# EAGLE design ridicideskaV3 (EAGLE 7.2.0)
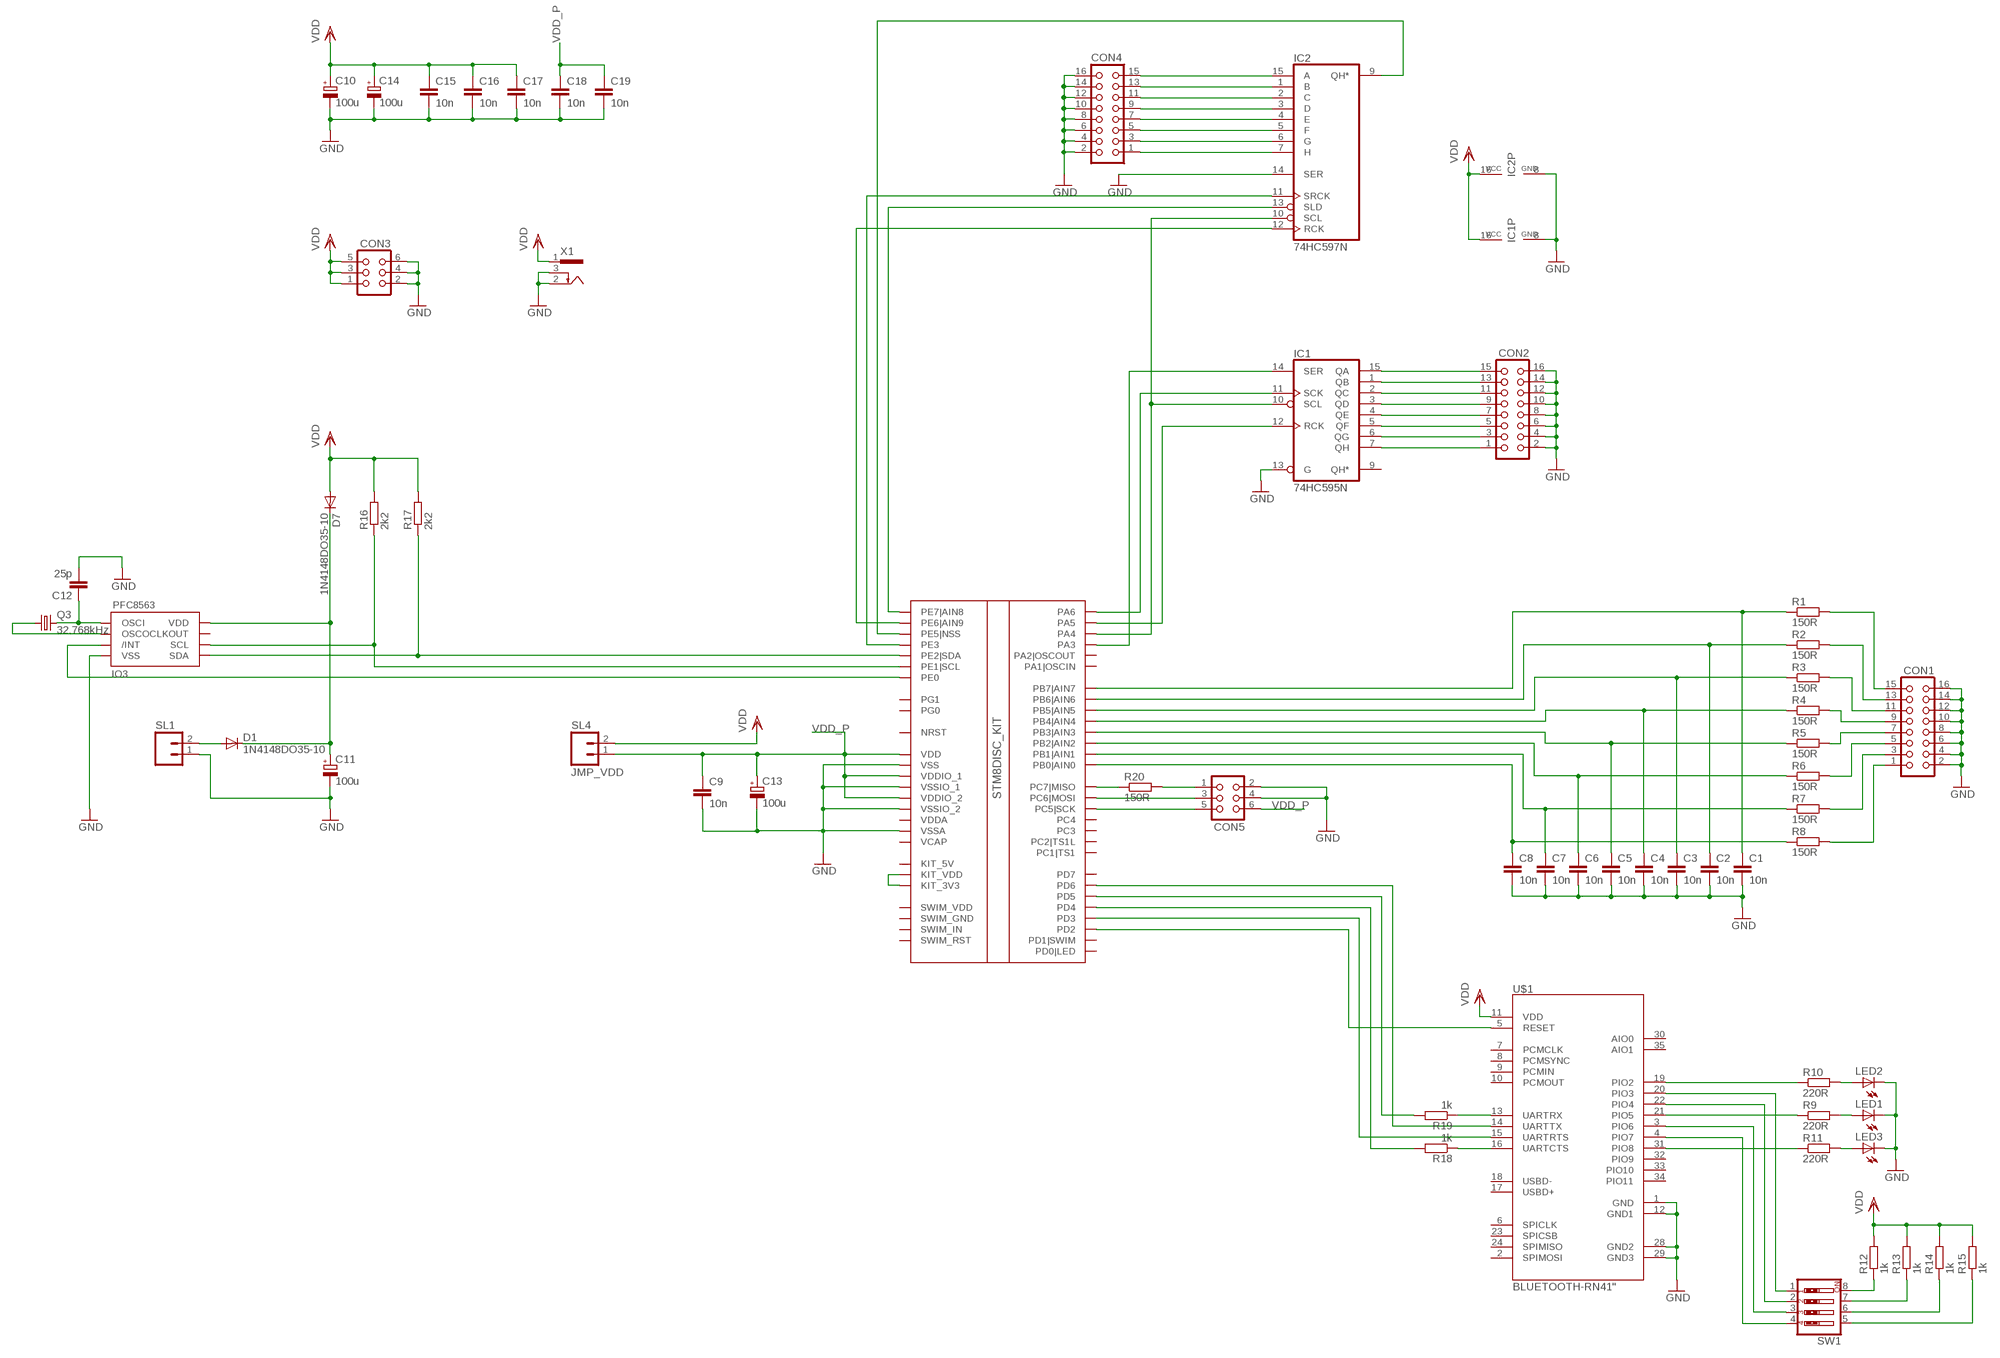
[diagram p0: schematic, sheet 1]

## Parts
C1  10n  C-EUC0805  [C0805]
C2  10n  C-EUC0805  [C0805]
C3  10n  C-EUC0805  [C0805]
C4  10n  C-EUC0805  [C0805]
C5  10n  C-EUC0805  [C0805]
C6  10n  C-EUC0805  [C0805]
C7  10n  C-EUC0805  [C0805]
C8  10n  C-EUC0805  [C0805]
C9  10n  C-EU050-045X075  [C050-045X075]
C10  100u  CPOL-EUE5-10.5  [E5-10,5]
C11  100u  CPOL-EUE5-10.5  [E5-10,5]
C12  25p  C-EUC0603  [C0603]
C13  100u  CPOL-EUE5-10.5  [E5-10,5]
C14  100u  CPOL-EUE5-10.5  [E5-10,5]
C15  10n  C-EU050-045X075  [C050-045X075]
C16  10n  C-EU050-045X075  [C050-045X075]
C17  10n  C-EUC0805  [C0805]
C18  10n  C-EUC0805  [C0805]
C19  10n  C-EUC0805  [C0805]
CON1  CON16  [CON16]
CON2  CON16  [CON16]
CON3  CON06  [CON06]
CON4  CON16  [CON16]
CON5  CON06  [CON06]
D1  1N4148DO35-10  [DO35-10]
D7  1N4148DO35-10  [DO35-10]
IC1  74HC595N  [DIL16]
IC2  74HC597N  [DIL16]
IO1  STM8_KIT  [STM8SDISCOVERY]
IO3  PFC8563  [SO08]
LED1  LED3MM  [LED3MM]
LED2  LED3MM  [LED3MM]
LED3  LED3MM  [LED3MM]
Q3  32.768kHz  CRYSTALTC26V  [TC26V]
R1  150R  R-EU_0207/12  [0207/12]
R2  150R  R-EU_0207/12  [0207/12]
R3  150R  R-EU_0207/12  [0207/12]
R4  150R  R-EU_0207/12  [0207/12]
R5  150R  R-EU_0207/12  [0207/12]
R6  150R  R-EU_0207/12  [0207/12]
R7  150R  R-EU_0207/12  [0207/12]
R8  150R  R-EU_0207/12  [0207/12]
R9  220R  R-EU_0207/12  [0207/12]
R10  220R  R-EU_0207/12  [0207/12]
R11  220R  R-EU_0207/12  [0207/12]
R12  1k  R-EU_0207/12  [0207/12]
R13  1k  R-EU_0207/12  [0207/12]
R14  1k  R-EU_0207/12  [0207/12]
R15  1k  R-EU_0207/12  [0207/12]
R16  2k2  R-EU_0207/12  [0207/12]
R17  2k2  R-EU_0207/12  [0207/12]
R18  1k  R-EU_0207/12  [0207/12]
R19  1k  R-EU_0207/12  [0207/12]
R20  150R  R-EU_R0805  [R0805]
SL1  M02  [02P]
SL4  JMP_VDD  M02  [02P]
SW1  SW_DIP-4  [EDG-04]
U$1  BLUETOOTH-RN41"  [RN41]
X1  733980-62  [733980-62]

## Nets
GND: C1.2 C2.2 C3.2 C4.2 C5.2 C6.2 C7.2 C8.2 C9.2 C10.- C11.- C12.2 C13.- C14.- C15.2 C16.2 C17.2 C18.2 C19.2 CON1.2 CON1.4 CON1.6 CON1.8 CON1.10 CON1.12 CON1.14 CON1.16 CON2.2 CON2.4 CON2.6 CON2.8 CON2.10 CON2.12 CON2.14 CON2.16 CON3.2 CON3.4 CON3.6 CON4.2 CON4.4 CON4.6 CON4.8 CON4.10 CON4.12 CON4.14 CON4.16 CON5.2 CON5.4 IC1.8(GND) IC1.13(G) IC2.8(GND) IC2.14(SER) IO1.VSS IO1.VSSA IO1.VSSIO_1 IO1.VSSIO_2 IO3.4(VSS) LED1.K(C) LED2.K(C) LED3.K(C) SL1.1 U$1.1(GND) U$1.12(GND1) U$1.28(GND2) U$1.29(GND3) X1.2 X1.3
N$1: IC1.14(SER) IO1.PA3
N$2: D1.A SL1.2
N$3: C8.1 IO1.PB0(PB0|AIN0) R8.1
N$4: C7.1 IO1.PB1(PB1|AIN1) R7.1
N$5: C6.1 IO1.PB2(PB2|AIN2) R6.1
N$6: CON1.15 R1.2
N$7: CON1.13 R2.2
N$8: CON1.11 R3.2
N$9: CON1.9 R4.2
N$10: CON1.1 R8.2
N$11: IC1.11(SCK) IO1.PA6
N$12: IC1.10(SCL) IC2.10(SCL) IO1.PA4
N$13: IC1.12(RCK) IO1.PA5
N$14: CON2.15 IC1.15(QA)
N$15: CON2.13 IC1.1(QB)
N$16: CON2.11 IC1.2(QC)
N$17: CON2.9 IC1.3(QD)
N$18: CON2.7 IC1.4(QE)
N$19: CON2.5 IC1.5(QF)
N$20: CON2.3 IC1.6(QG)
N$21: CON2.1 IC1.7(QH)
N$22: IC2.13(SLD) IO1.PE7(PE7|AIN8)
N$23: IO1.PE2(PE2|SDA) IO3.5(SDA) R17.1
N$24: IC2.9(QH*) IO1.PE5(PE5|NSS)
N$25: CON1.3 R7.2
N$26: C5.1 IO1.PB3(PB3|AIN3) R5.1
N$27: C1.1 IO1.PB7(PB7|AIN7) R1.1
N$28: IO1.PE1(PE1|SCL) IO3.6(SCL) R16.1
N$29: C11.+ D1.C D7.C IO3.8(VDD)
N$30: IO1.PE0 IO3.3(/INT)
N$31: CON4.15 IC2.15(A)
N$32: CON4.13 IC2.1(B)
N$33: CON4.11 IC2.2(C)
N$34: CON4.9 IC2.3(D)
N$35: CON4.7 IC2.4(E)
N$36: CON4.5 IC2.5(F)
N$37: CON4.3 IC2.6(G)
N$38: CON4.1 IC2.7(H)
N$39: C12.1 IO3.1(OSCI) Q3.2
N$40: IO3.2(OSCO) Q3.1
N$41: C2.1 IO1.PB6(PB6|AIN6) R2.1
N$42: R19.1 U$1.13(UARTRX)
N$43: C3.1 IO1.PB5(PB5|AIN5) R3.1
N$44: C4.1 IO1.PB4(PB4|AIN4) R4.1
N$45: CON1.5 R6.2
N$46: CON1.7 R5.2
N$47: IO1.PD5 R19.2
N$48: IO1.PD6 U$1.14(UARTTX)
N$49: LED1.A R9.2
N$50: R9.1 U$1.21(PIO5)
N$51: R10.1 U$1.19(PIO2)
N$52: LED2.A R10.2
N$53: SW1.1 U$1.20(PIO3)
N$54: SW1.2 U$1.22(PIO4)
N$55: SW1.3 U$1.3(PIO6)
N$56: SW1.4 U$1.4(PIO7)
N$57: R11.1 U$1.31(PIO8)
N$58: LED3.A R11.2
N$59: R12.1 SW1.8
N$60: R13.1 SW1.7
N$61: R14.1 SW1.6
N$62: R15.1 SW1.5
N$63: IO1.PD4 R18.2
N$64: IO1.PD3 U$1.15(UARTRTS)
N$65: R18.1 U$1.16(UARTCTS)
N$66: IC2.12(RCK) IO1.PE6(PE6|AIN9)
N$67: IC2.11(SRCK) IO1.PE3
N$68: IO1.KIT_3V3 IO1.KIT_VDD
N$69: IO1.PD2 U$1.5(RESET)
N$70: IO1.PC7(PC7|MISO) R20.1
N$71: CON5.1 R20.2
N$72: CON5.3 IO1.PC6(PC6|MOSI)
N$73: CON5.5 IO1.PC5(PC5|SCK)
VDD: C10.+ C14.+ C15.1 C16.1 C17.1 CON3.1 CON3.3 CON3.5 D7.A IC1.16(VCC) IC2.16(VCC) R12.2 R13.2 R14.2 R15.2 R16.2 R17.2 SL4.2 U$1.11(VDD) X1.1
VDD_P: C9.1 C13.+ C18.1 C19.1 CON5.6 IO1.VDD IO1.VDDIO_1 IO1.VDDIO_2 SL4.1
Unconnected: IC1.9(QH*) IO1.KIT_5V IO1.NRST IO1.PA1(PA1|OSCIN) IO1.PA2(PA2|OSCOUT) IO1.PC1(PC1|TS1) IO1.PC2(PC2|TS1L) IO1.PC3 IO1.PC4 IO1.PD0(PD0|LED) IO1.PD1(PD1|SWIM) IO1.PD7 IO1.PG0 IO1.PG1 IO1.SWIM_GND IO1.SWIM_IN IO1.SWIM_RST IO1.SWIM_VDD IO1.VCAP IO1.VDDA IO3.7(CLKOUT) U$1.2(SPIMOSI) U$1.6(SPICLK) U$1.7(PCMCLK) U$1.8(PCMSYNC) U$1.9(PCMIN) U$1.10(PCMOUT) U$1.17(USBD+) U$1.18(USBD-) U$1.23(SPICSB) U$1.24(SPIMISO) U$1.30(AIO0) U$1.32(PIO9) U$1.33(PIO10) U$1.34(PIO11) U$1.35(AIO1)

## Library data of the parts
C1-C9 C12 C15-C19 = rcl:C-EU: CAPACITOR, European symbol
C10 C11 C13 C14 = resistor:CPOL-EU: POLARIZED CAPACITOR, European symbol
CON1 CON2 CON4 = con-harting:CON16: CONNECTOR; OC_FARNELL: unknown; OC_NEWARK: unknown
CON3 CON5 = con-harting:CON06: CONNECTOR; OC_FARNELL: unknown; OC_NEWARK: unknown
D1 D7 = diode:1N4148: DIODE high speed (Philips)
IC1 = 74xx-eu:74*595: 8-bit SHIFT REGISTER, output latch
IC2 = 74xx-eu:74*597: 8-bit SHIFT REGISTER, input latch
IO1 = atypPouzdra:STM8_KIT
IO3 = atypPouzdra:PFC8563
LED1-LED3 = led:LED: LED OSRAM: - CHIPLED LG R971, LG N971, LY N971, LG Q971, LY Q971, LO R971, LY R971 LH N974, LH R974 LS Q976, LO Q976, LY Q976 LO Q996 - Hyper CHIPLED LW Q18S LB Q993, LB Q99A, LB R99A - SideLED LS A670, LO A670, LY A670, LG A670, LP A670 LB A673, LV A673, LT A673, LW A673 LH A674 LY A675 LS A676, LA A676, LO A676, LY A676, LW A676 LS A679, LY A679, LG A679 - Hyper Micro SIDELED® LS Y876, LA Y876, LO Y876, LY Y876 LT Y87S - SmartLED LW L88C, LW L88S LB L89C, LB L89S, LG L890 LS L89K, LO L89K, LY L89K LS L896, LA L896, LO L896, LY L896 - TOPLED LS T670, LO T670, LY T670, LG T670, LP T670 LSG T670, LSP T670, LSY T670, LOP T670, LYG T670 LG T671, LOG T671, LSG T671 LB T673, LV T673, LT T673, LW T673 LH T674 LS T676, LA T676, LO T676, LY T676, LB T676, LH T676, LSB T676, LW T676 LB T67C, LV T67C, LT T67C, LS T67K, LO T67K, LY T67K, LW E67C LS E67B, LA E67B, LO E67B, LY E67B, LB E67C, LV E67C, LT E67C LW T67C LS T679, LY T679, LG T679 LS T770, LO T770, LY T770, LG T770, LP T770 LB T773, LV T773, LT T773, LW T773 LH T774 LS E675, LA E675, LY E675, LS T675 LS T776, LA T776, LO T776, LY T776, LB T776 LHGB T686 LT T68C, LB T68C - Hyper Mini TOPLED® LB M676 - Mini TOPLED Santana® LG M470 LS M47K, LO M47K, LY M47K Source: http://www.osram.convergy.de LUXEON: - LUMILED® LXK2-PW12-R00, LXK2-PW12-S00, LXK2-PW14-U00, LXK2-PW14-V00 LXK2-PM12-R00, LXK2-PM12-S00, LXK2-PM14-U00 LXK2-PE12-Q00, LXK2-PE12-R00, LXK2-PE12-S00, LXK2-PE14-T00, LXK2-PE14-U00 LXK2-PB12-K00, LXK2-PB12-L00, LXK2-PB12-M00, LXK2-PB14-N00, LXK2-PB14-P00, LXK2-PB14-Q00 LXK2-PR12-L00, LXK2-PR12-M00, LXK2-PR14-Q00, LXK2-PR14-R00 LXK2-PD12-Q00, LXK2-PD12-R00, LXK2-PD12-S00 LXK2-PH12-R00, LXK2-PH12-S00 LXK2-PL12-P00, LXK2-PL12-Q00, LXK2-PL12-R00 Source: www.luxeon.com KINGBRIGHT: KA-3528ASYC Source: www.kingbright.com
Q3 = crystal:CRYSTAL: CRYSTAL; OC_FARNELL: unknown; OC_NEWARK: unknown
R1-R20 = rcl:R-EU_: RESISTOR, European symbol
SL1 SL4 = con-amp-quick:M02: AMP QUICK CONNECTOR; OC_FARNELL: unknown; OC_NEWARK: unknown
SW1 = special:SW_DIP-4: DIP SWITCH
U$1 = SparkFun-RF:BLUETOOTH-RN41: Bluetooth SMD module
X1 = con-conrad:73398?: FEMALE PRINT CONNECTOR Niedervolt-Steckverbinder Distributor Conrad

## Board
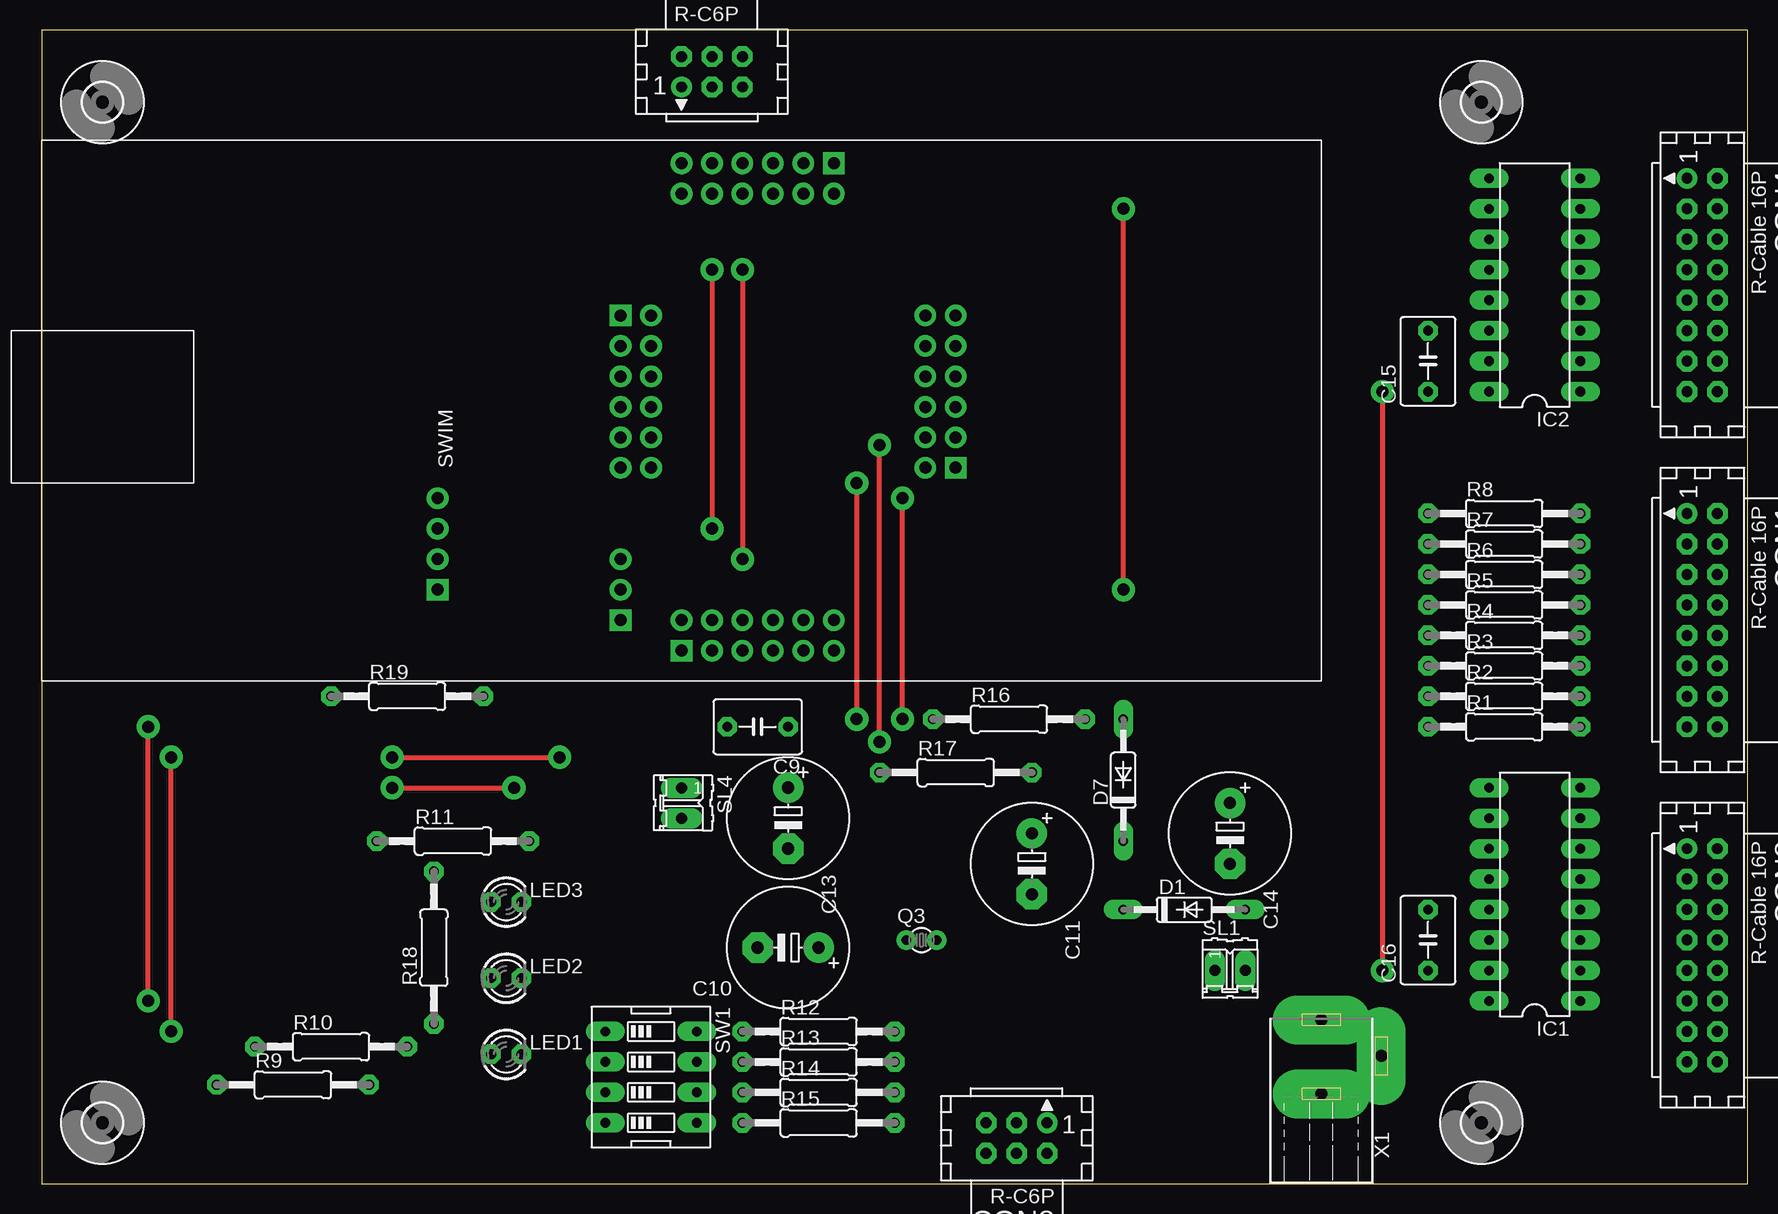
[diagram p1: board, top side]
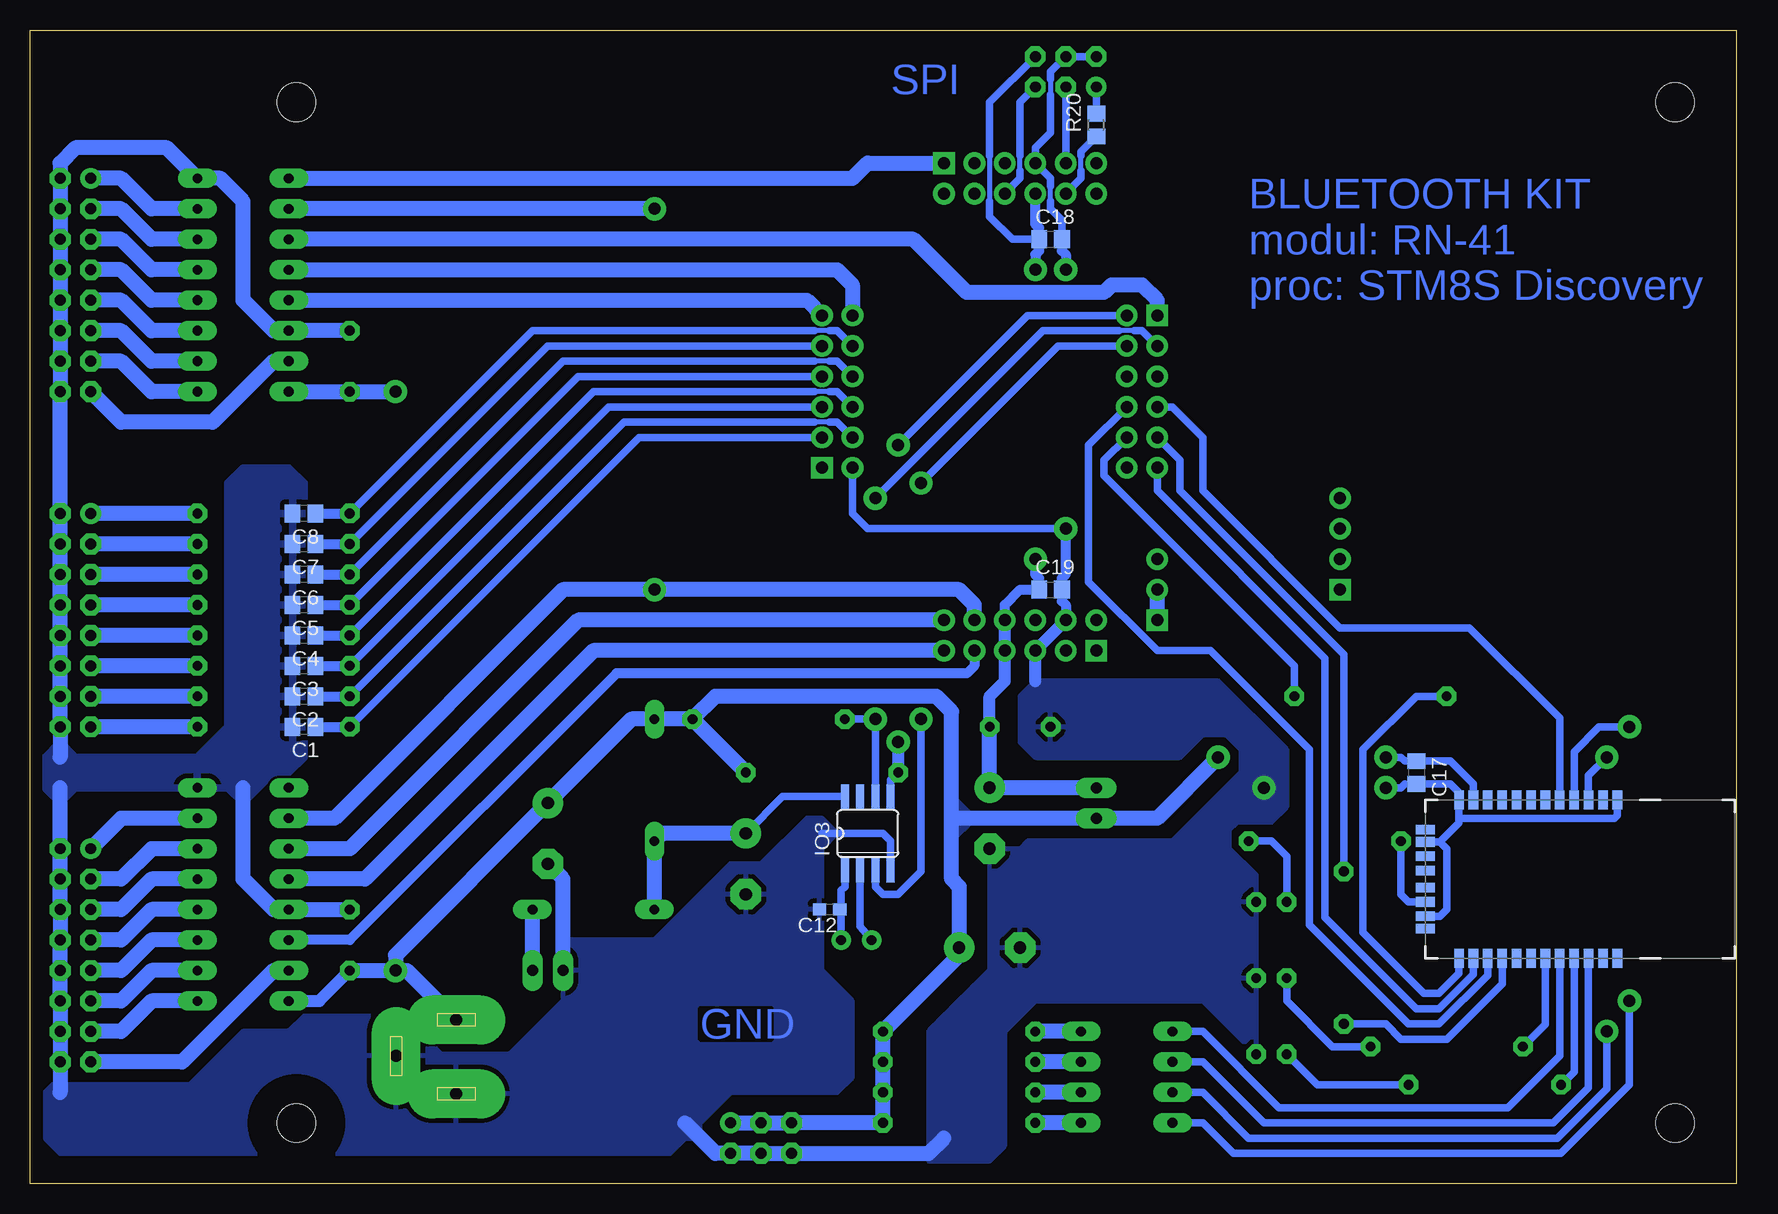
[diagram p2: board, bottom side, seen from below]

Size 142.22 x 96.19 mm. Coordinates in mm from the lower left corner, seen from the top.
Outline: 0,0 142.22,0 142.22,96.19 0,96.19 0,0
Copper layers (1*16): Top 0.035mm / dielectric 1.5mm / Bottom 0.035mm
Design rules "default *": minimum track width 10mil, minimum drill 24mil, track to track 8mil, track to pad 8mil, pad to pad 8mil, via to via 8mil, smd to smd 8mil, copper to edge 40mil, drill to drill 8mil, minimum pad ring 10mil, minimum via ring 8mil, stop-mask expansion 4mil, vias tented up to drill 0mil, thermal gap 16mil

### Footprints (pad centres in the part's own frame; a part is rotated, then mirrored left to right if it is on the bottom)
C0805 = smd 1.3 x 1.5: 1 -0.95,0; 2 0.95,0
C050-045X075 = drill 0.813 octagon: 1 -2.54,0; 2 2.54,0
E5-10,5 = drill 1.016 pad 2.54: + -2.54,0 | drill 1.016 pad 2.54 octagon: - 2.54,0
C0603 = smd 1.1 x 1: 1 -0.85,0; 2 0.85,0
CON16 = drill 0.914: 1 -8.89,-1.27 | drill 0.914 octagon: 2 -8.89,1.27; 3 -6.35,-1.27; 4 -6.35,1.27; 5 -3.81,-1.27; 6 -3.81,1.27; 7 -1.27,-1.27; 8 -1.27,1.27; 9 1.27,-1.27; 10 1.27,1.27; 11 3.81,-1.27; 12 3.81,1.27; 13 6.35,-1.27; 14 6.35,1.27; 15 8.89,-1.27; 16 8.89,1.27
CON06 = drill 0.914: 1 -2.54,-1.27 | drill 0.914 octagon: 2 -2.54,1.27; 3 0,-1.27; 4 0,1.27; 5 2.54,-1.27; 6 2.54,1.27
DO35-10 = drill 0.813 long: A 5.08,0; C -5.08,0
DIL16 = drill 0.813 long: 1 -8.89,-3.81; 2 -6.35,-3.81; 3 -3.81,-3.81; 4 -1.27,-3.81; 5 1.27,-3.81; 6 3.81,-3.81; 7 6.35,-3.81; 8 8.89,-3.81; 9 8.89,3.81; 10 6.35,3.81; 11 3.81,3.81; 12 1.27,3.81; 13 -1.27,3.81; 14 -3.81,3.81; 15 -6.35,3.81; 16 -8.89,3.81
STM8SDISCOVERY = drill 1 pad 1.778 square: KIT_3V3 -19.05,15.24; NRST -21.59,10.16; PE3 6.35,15.24; PE5 19.05,-2.54; SWIM_VDD -16.51,30.48; VDDA -6.35,-12.7 | drill 1 pad 1.778: KIT_5V -13.97,15.24; KIT_VDD -16.51,15.24; PA1 -19.05,10.16; PA2 -21.59,7.62; PA3 -21.59,0; PA4 -19.05,0; PA5 -21.59,-2.54; PA6 -19.05,-2.54; PB0 3.81,-10.16; PB1 3.81,-12.7; PB2 1.27,-10.16; PB3 1.27,-12.7; PB4 -1.27,-10.16; PB5 -1.27,-12.7; PB6 -3.81,-10.16; PB7 -3.81,-12.7; PC1 16.51,-2.54; PC2 19.05,0; PC3 16.51,0; PC4 19.05,2.54; PC5 16.51,2.54; PC6 19.05,7.62; PC7 16.51,7.62; PD0 1.27,15.24; PD1 1.27,12.7; PD2 -1.27,15.24; PD3 -1.27,12.7; PD4 -3.81,15.24; PD5 -3.81,12.7; PD6 -6.35,15.24; PD7 -6.35,12.7; PE0 3.81,12.7; PE1 3.81,15.24; PE2 6.35,12.7; PE6 6.35,-10.16; PE7 6.35,-12.7; PG0 19.05,10.16; PG1 16.51,10.16; SWIM_GND -11.43,30.48; SWIM_IN -13.97,30.48; SWIM_RST -8.89,30.48; VCAP -19.05,5.08; VDD -21.59,2.54; VDDIO_1 -19.05,2.54; VDDIO_2 16.51,5.08; VSS -21.59,5.08; VSSA -6.35,-10.16; VSSIO_1 -19.05,7.62; VSSIO_2 19.05,5.08
SO08 = smd 0.66 x 2.032: 1 -1.905,-3.073; 2 -0.635,-3.073; 3 0.635,-3.073; 4 1.905,-3.073; 5 1.905,3.073; 6 0.635,3.073; 7 -0.635,3.073; 8 -1.905,3.073
LED3MM = drill 0.813 octagon: A -1.27,0; K 1.27,0
TC26V = drill 0.813: 1 -1.27,0; 2 1.27,0
0207/12 = drill 0.813 octagon: 1 -6.35,0; 2 6.35,0
R0805 = smd 1.3 x 1.5: 1 -0.95,0; 2 0.95,0
02P = drill 0.914 long: 1 -1.27,0; 2 1.27,0
EDG-04 = drill 0.813 long: 1 -3.81,-3.81; 2 -1.27,-3.81; 3 1.27,-3.81; 4 3.81,-3.81; 5 3.81,3.81; 6 1.27,3.81; 7 -1.27,3.81; 8 -3.81,3.81
RN41 = smd 0.8 x 1.6: 1 -6.6,-6.6; 2 -5.4,-6.6; 3 -4.2,-6.6; 4 -3,-6.6; 5 -1.8,-6.6; 6 -0.6,-6.6; 7 0.6,-6.6; 8 1.8,-6.6; 9 3,-6.6; 10 4.2,-6.6; 11 5.4,-6.6; 12 6.6,-6.6; 13 6.6,6.6; 14 5.4,6.6; 15 4.2,6.6; 16 3,6.6; 17 1.8,6.6; 18 0.6,6.6; 19 -0.6,6.6; 20 -1.8,6.6; 21 -3,6.6; 22 -4.2,6.6; 23 -5.4,6.6; 24 -6.6,6.6 | smd 1.6 x 0.8: 28 9.4,3.1; 29 9.4,-3.1; 30 9.4,4.122; 31 9.4,1.9; 32 9.4,0.7; 33 9.4,-0.7; 34 9.4,-1.9; 35 9.4,-4.122
3,2 = hole 3.2: 0,0
733980-62 = drill 1 pad 4.064 long: 1 0,8.57; 2 0,2.42; 3 5,5.57

### Placement (x,y rotation side)
C1  119.38,38.1 180 bottom
C2  119.38,40.64 180 bottom
C3  119.38,43.18 180 bottom
C4  119.38,45.72 180 bottom
C5  119.38,48.26 180 bottom
C6  119.38,50.8 180 bottom
C7  119.38,53.34 180 bottom
C8  119.38,55.88 180 bottom
C9  59.69,38.1 180 top
C10  62.23,19.68 180 top
C11  82.55,26.67 270 top
C12  75.56,22.86 180 bottom
C13  62.23,30.48 270 top
C14  99.06,29.21 270 top
C15  115.57,68.58 90 top
C16  115.57,20.32 90 top
C17  26.67,34.29 270 bottom
C18  57.15,78.74 0 bottom
C19  57.15,49.53 0 bottom
CON1  138.43,46.99 270 top
CON2  138.43,19.05 270 top
CON3  81.28,3.81 180 top
CON4  138.43,74.93 270 top
CON5  55.88,92.71 0 top
D1  95.25,22.86 0 top
D7  90.17,33.66 90 top
IC1  124.46,24.13 90 top
IC2  124.46,74.93 90 top
IO1  63.5,66.04 90 top
IO3  72.39,29.21 0 bottom
LED1  38.73,10.79 0 top
LED2  38.73,17.14 0 top
LED3  38.73,23.5 0 top
Q3  73.34,20.32 0 top
R1  121.92,38.1 0 top
R2  121.92,40.64 0 top
R3  121.92,43.18 0 top
R4  121.92,45.72 0 top
R5  121.92,48.26 0 top
R6  121.92,50.8 0 top
R7  121.92,53.34 0 top
R8  121.92,55.88 0 top
R9  20.95,8.26 0 top
R10  24.13,11.43 0 top
R11  34.29,28.57 0 top
R12  64.77,12.7 0 top
R13  64.77,10.16 0 top
R14  64.77,7.62 0 top
R15  64.77,5.08 0 top
R16  80.64,38.73 0 top
R17  76.2,34.29 0 top
R18  32.7,19.68 90 top
R19  30.48,40.64 0 top
R20  53.34,88.27 90 bottom
SL1  99.06,17.78 0 top
SL4  53.34,31.75 270 top
SW1  50.8,8.89 270 top
U$1  16.51,25.4 180 bottom
U$2  [3,2]  5.08,90.17 0 top
U$3  [3,2]  5.08,5.08 0 top
U$4  [3,2]  120.02,5.08 0 top
U$5  [3,2]  120.02,90.17 0 top
X1  106.68,5.08 0 top

### Tracks (layer width: path | path; a pad name or v marks a point on that pad's centre or on a via)
GND  (via drill 1 pad 1.93)
  Top 0.406: v55.88,76.2 v55.88,54.61 | v29.21,33.02 v39.37,33.02
  Bottom 0.406: C17.2 27.62,33.34 | 57.15,92.08 57.15,90.81 | 57.15,81.92 57.15,83.19
  Bottom 0.61: U$1.28 24.69,22.3 24.13,22.86 24.13,27.94 24.69,28.5 | U$1.29 24.69,28.5 | 23.11,30.48 23.11,30.08 24.69,28.5 | U$1.1 9.91,30.73 10.16,30.48 23.11,30.48 | 23.11,30.48 U$1.12 23.11,32.63 23.82,33.34 C17.2 | 27.62,33.34 27.94,33.02 v29.21,33.02 | C18.2 56.2,80.33 57.15,81.28 57.15,81.92 | IO3.4 70.48,28.57 71.12,29.21 76.2,29.21 | v55.88,54.61 72.39,54.61 73.66,55.88 IO1.VSSA | 57.15,90.81 57.15,87.63 58.42,86.36 IO1.VSSIO_2 57.15,83.82 57.15,83.19 | 57.15,92.08 57.15,92.71 CON5.4 CON5.2
  Bottom 0.813: IO1.VSSIO_1 55.88,48.26 56.2,48.58 C19.2 56.2,50.48 55.88,50.8 v55.88,54.61 | C18.2 56.2,77.79 55.88,77.47 v55.88,76.2
  Bottom 1.016: IO1.VSSIO_1 IO1.VSS 58.42,41.91
  Bottom 1.27: C15.2 IC2.14 121.92,71.12 124.46,73.66 124.46,81.92 126.36,83.82 IC2.8 130.81,86.36 138.43,86.36 139.7,85.09 CON4.2 CON4.4 CON4.6 CON4.8 CON4.10 CON4.12 CON4.14 CON4.16 CON1.2 CON1.4 CON1.6 CON1.8 CON1.10 CON1.12 CON1.14 CON1.16 139.7,35.56 | C16.2 IC1.13 121.92,22.86 124.46,25.4 124.46,33.02 | 66.04,3.81 67.31,2.54 CON3.6 CON3.4 CON3.2 85.09,2.54 87.63,5.08 | SL1.1 97.79,25.4 C14.- | 139.7,7.62 CON2.16 CON2.14 CON2.12 CON2.10 CON2.8 CON2.6 CON2.4 CON2.2 139.7,33.02
  pour Bottom: 40.01,10.79 40.01,25.72 42.23,27.94 42.23,29.53 41.59,30.16 38.73,30.16 37.47,31.43 37.47,36.2 43.18,41.91 58.42,41.91 59.69,40.64 59.69,36.83 58.42,35.56 46.35,35.56 44.45,37.47 42.55,37.47 41.27,36.2 41.27,34.29 46.99,28.57 59.05,28.57 59.69,27.94 62.23,27.94 62.23,17.78 67.31,12.7 67.31,1.91 62.23,1.91 60.96,3.17 60.96,12.7 58.42,15.24 44.45,15.24
  pour Bottom: 86.36,3.81 86.36,5.08 83.82,7.62 74.93,7.62 73.66,8.89 73.66,15.24 76.2,17.78 76.2,27.94 74.93,29.21 76.2,30.48 77.47,30.48 81.28,26.67 83.82,26.67 90.17,20.32 97.79,20.32 97.79,15.24 102.23,10.79 107.95,10.79 111.12,13.97 119.38,13.97 120.65,12.7 124.46,12.7 128.91,8.26 140.34,8.26 140.97,7.62 140.97,3.81 139.7,2.54 88.9,2.54 87.63,3.81
  pour Bottom: 120.65,59.69 119.38,58.42 119.38,35.56 120.65,34.29 121.92,34.29 124.46,31.75 125.73,33.02 138.43,33.02 139.7,31.75 140.97,33.02 140.97,35.56 139.7,36.83 138.43,35.56 128.27,35.56 125.73,38.1 125.73,58.42 124.46,59.69
N$1
  Bottom 0.813: IO1.PA3 63.5,43.18 64.14,42.55 93.34,42.55 115.57,20.32 IC1.14
N$2
  Bottom 1.27: SL1.2 D1.A
N$3
  Bottom 0.406: 75.56,71.12 76.83,71.12
  Bottom 0.61: R8.1 100.33,71.12 76.83,71.12 | IO1.PB0 74.93,71.12 75.56,71.12
  Bottom 0.813: C8.1 R8.1
N$4
  Bottom 0.61: IO1.PB1 99.06,69.85 R7.1
  Bottom 0.813: C7.1 R7.1
N$5
  Bottom 0.406: 75.56,68.58 76.83,68.58
  Bottom 0.61: R6.1 97.79,68.58 76.83,68.58 | IO1.PB2 74.93,68.58 75.56,68.58
  Bottom 0.813: C6.1 R6.1
N$6
  Bottom 1.27: R1.2 CON1.15
N$7
  Bottom 1.27: R2.2 CON1.13
N$8
  Bottom 1.27: R3.2 CON1.11
N$9
  Bottom 1.27: R4.2 CON1.9
N$10
  Bottom 1.27: R8.2 CON1.1
N$11
  Bottom 1.27: IO1.PA6 96.52,46.99 115.57,27.94 IC1.11
N$12  (via drill 1 pad 1.93)
  Top 0.406: v90.17,49.53 v90.17,81.28
  Bottom 1.27: IO1.PA4 63.5,48.26 64.77,49.53 v90.17,49.53 97.79,49.53 116.84,30.48 IC1.10 | v90.17,81.28 IC2.10
N$13
  Bottom 1.27: IO1.PA5 95.25,44.45 114.3,25.4 IC1.12
N$14
  Bottom 1.27: IC1.15 121.92,17.78 129.54,10.16 CON2.15
N$15
  Bottom 1.27: IC1.1 132.08,15.24 134.62,12.7 CON2.13
N$16
  Bottom 1.27: IC1.2 132.08,17.78 134.62,15.24 CON2.11
N$17
  Bottom 1.27: IC1.3 132.08,20.32 134.62,17.78 CON2.9
N$18
  Bottom 1.27: IC1.4 132.08,22.86 134.62,20.32 CON2.7
N$19
  Bottom 1.27: IC1.5 132.08,25.4 134.62,22.86 CON2.5
N$20
  Bottom 1.27: IC1.6 132.08,27.94 134.62,25.4 CON2.3
N$21
  Bottom 1.27: IC1.7 134.62,30.48 CON2.1
N$22
  Bottom 1.27: IC2.13 77.47,73.66 IO1.PE7
N$23  (via drill 1 pad 1.93)
  Top 0.406: v69.85,36.83 v69.85,61.59
  Bottom 0.61: IO3.5 70.48,33.66 R17.1 | IO1.PE2 59.05,72.39 v69.85,61.59
  Bottom 1.016: v69.85,36.83 R17.1
N$24
  Bottom 1.27: IC2.9 73.66,83.82 72.39,85.09 IO1.PE5
N$25
  Bottom 1.27: R7.2 CON1.3
N$26
  Bottom 0.61: IO1.PB3 96.52,67.31 R5.1
  Bottom 0.813: C5.1 R5.1
N$27
  Bottom 0.61: IO1.PB7 91.44,62.23 R1.1
  Bottom 0.813: C1.1 R1.1
N$28  (via drill 1 pad 1.93)
  Top 0.406: v71.75,38.73 v71.75,57.15
  Bottom 0.406: 50.16,71.12 51.44,71.12
  Bottom 0.61: IO3.6 v71.75,38.73 R16.1 | 51.44,71.12 57.78,71.12 v71.75,57.15 | IO1.PE1 49.53,71.12 50.16,71.12
N$29
  Bottom 0.61: IO3.8 79.48,32.28 C11.+
  Bottom 1.27: D1.C D7.C 89.53,29.21 C11.+
N$30  (via drill 1 pad 1.93)
  Top 0.406: v67.94,58.42 v67.94,38.73
  Bottom 0.61: IO3.3 71.75,24.77 71.12,24.13 69.85,24.13 67.94,26.04 v67.94,38.73 | IO1.PE0 56.52,69.85 v67.94,58.42
N$31
  Bottom 1.27: IC2.15 121.92,68.58 127,63.5 134.62,63.5 CON4.15
N$32
  Bottom 1.27: IC2.1 132.08,66.04 134.62,68.58 CON4.13
N$33
  Bottom 1.27: IC2.2 132.08,68.58 134.62,71.12 CON4.11
N$34
  Bottom 1.27: IC2.3 132.08,71.12 134.62,73.66 CON4.9
N$35
  Bottom 1.27: IC2.4 132.08,73.66 134.62,76.2 CON4.7
N$36
  Bottom 1.27: IC2.5 132.08,76.2 134.62,78.74 CON4.5
N$37
  Bottom 1.27: IC2.6 132.08,78.74 134.62,81.28 CON4.3
N$38
  Bottom 1.27: IC2.7 132.08,81.28 134.62,83.82 CON4.1
N$39
  Bottom 0.61: IO3.1 74.3,24.77 74.61,24.45 74.61,22.86 C12.1 74.61,22.86 Q3.2
N$40
  Bottom 0.61: IO3.2 73.03,21.46 Q3.1
N$41
  Bottom 0.406: 75.56,63.5 76.83,63.5
  Bottom 0.61: R2.1 92.71,63.5 76.83,63.5 | IO1.PB6 74.93,63.5 75.56,63.5
  Bottom 0.813: C2.1 R2.1
N$42
  Bottom 0.61: U$1.13 23.11,17.53 24.77,15.88 26.04,15.88 31.11,20.95 31.11,36.2 26.67,40.64 R19.1
N$43
  Bottom 0.61: IO1.PB5 93.98,64.77 R3.1
  Bottom 0.813: C3.1 R3.1
N$44
  Bottom 0.406: 75.56,66.04 76.83,66.04
  Bottom 0.61: R4.1 95.25,66.04 76.83,66.04 | IO1.PB4 74.93,66.04 75.56,66.04
  Bottom 0.813: C4.1 R4.1
N$45
  Bottom 1.27: R6.2 CON1.5
N$46
  Bottom 1.27: R5.2 CON1.7
N$47
  Bottom 0.61: R19.2 36.83,43.18 52.7,59.05 52.7,60.33 IO1.PD5
N$48
  Bottom 0.61: U$1.14 21.91,17.46 24.77,14.61 26.67,14.61 34.29,22.23 34.29,43.81 48.26,57.78 IO1.PD6
N$49
  Bottom 0.61: R9.2 34.92,8.26 LED1.A
N$50
  Bottom 0.61: U$1.21 13.51,9.35 R9.1
N$51
  Bottom 0.61: U$1.19 15.91,13.3 R10.1
N$52
  Bottom 0.61: R10.2 33.66,11.43 37.47,15.24 LED2.A
N$53
  Bottom 0.61: SW1.1 44.45,12.7 38.1,6.35 19.05,6.35 14.71,10.69 U$1.20
N$54
  Bottom 0.61: SW1.2 44.45,10.16 39.37,5.08 15.24,5.08 12.31,8.01 U$1.22
N$55  (via drill 1 pad 1.93)
  Top 0.406: v10.79,12.7 v10.79,35.56
  Bottom 0.61: SW1.3 44.45,7.62 40.64,3.81 14.92,3.81 10.79,7.94 v10.79,12.7 | v10.79,35.56 12.31,34.05 U$1.3
N$56  (via drill 1 pad 1.93)
  Top 0.406: v8.89,15.24 v8.89,38.1
  Bottom 0.61: SW1.4 44.45,5.08 41.91,2.54 14.61,2.54 8.89,8.26 v8.89,15.24 | v8.89,38.1 11.43,38.1 13.51,36.02 U$1.4
N$57
  Bottom 0.61: U$1.31 27.31,23.5 27.94,24.13 R11.1
N$58
  Bottom 0.61: R11.2 38.73,28.57 37.47,27.3 LED3.A
N$59
  Bottom 1.27: SW1.8 R12.1
N$60
  Bottom 1.27: SW1.7 R13.1
N$61
  Bottom 1.27: SW1.6 R14.1
N$62
  Bottom 1.27: SW1.5 R15.1
N$63
  Bottom 0.61: R18.2 32.7,44.13 46.35,57.78 46.35,60.33 IO1.PD4
N$64
  Bottom 0.61: U$1.15 20.71,17.39 24.77,13.34 27.3,13.34 35.56,21.59 35.56,36.2 43.81,44.45 48.26,44.45 53.98,50.16 53.98,61.59 IO1.PD3
N$65
  Bottom 0.61: U$1.16 19.51,16.68 24.13,12.06 27.94,12.06 29.21,13.34 R18.1
N$66
  Bottom 1.27: IC2.12 74.93,76.2 73.66,74.93 IO1.PE6
N$67
  Bottom 1.27: IO1.PE3 48.26,73.66 49.53,74.93 52.07,74.93 52.7,74.3 64.14,74.3 68.58,78.74 IC2.11
N$68
  Bottom 1.27: IO1.KIT_3V3 IO1.KIT_VDD
N$69
  Bottom 0.61: U$1.5 14.71,38.84 22.23,46.35 33.02,46.35 44.45,57.78 44.45,62.23 46.99,64.77 IO1.PD2
N$70
  Bottom 0.406: 54.61,84.45 54.61,85.72
  Bottom 0.61: IO1.PC7 54.61,83.82 54.61,84.45 | R20.1 54.3,86.36 54.61,86.04 54.61,85.72
N$71
  Bottom 0.61: R20.2 CON5.1
N$72
  Bottom 0.61: IO1.PC6 CON5.3
N$73
  Bottom 0.406: 59.69,84.45 59.69,85.72
  Bottom 0.61: IO1.PC5 59.69,83.82 59.69,84.45 | 59.69,85.72 59.69,90.17 CON5.5
VDD  (via drill 1 pad 1.93)
  Top 0.406: v111.76,66.04 v111.76,17.78 | v29.21,35.56 v43.18,35.56
  Bottom 0.61: v29.21,35.56 27.94,35.56 27.62,35.24 C17.1 23.81,35.24 21.91,33.34 U$1.11
  Bottom 1.016: IC1.16 118.11,15.24 C16.1
  Bottom 1.27: IC2.16 C15.1 v111.76,66.04 | R16.2 D7.A 92.08,38.73 C14.+ 111.76,19.05 v111.76,17.78 | CON3.1 CON3.3 CON3.5 R15.2 R14.2 R13.2 R12.2 64.77,19.05 C10.+ 64.77,24.77 65.41,25.4 65.41,30.48 | 65.41,30.48 65.41,39.37 66.67,40.64 85.09,40.64 R16.2 | C16.1 v111.76,17.78 | v111.76,17.78 110.81,17.78 X1.1 | v43.18,35.56 48.26,30.48 SL4.2 65.41,30.48 | R17.2 R16.2
  pour Bottom: 65.41,28.57 63.5,30.48 65.41,32.38
VDD_P  (via drill 1 pad 1.93)
  Top 0.406: v58.42,76.2 v58.42,52.07
  Bottom 0.406: 62.23,85.72 62.23,81.92
  Bottom 0.61: CON5.6 62.23,90.17 62.23,85.72 | 62.23,81.92 62.23,80.64 60.33,78.74 C18.1
  Bottom 0.813: IO1.VDDIO_1 60.96,48.26 59.69,49.53 C19.1 58.1,50.48 58.42,50.8 v58.42,52.07 | v58.42,76.2 58.42,77.47 58.1,77.79 C18.1 58.1,79.69 58.42,80.01 IO1.VDDIO_2
  Bottom 1.016: IO1.VDDIO_1 IO1.VDD 60.96,41.91 62.23,40.64 C9.1
  Bottom 1.27: SL4.1 C13.+ C9.1

### Text on the board
Bottom: SPI | BLUETOOTH KIT / modul: RN-41 / proc: STM8S Discovery | GND